# Altium schematic sheet SCH-3.SchDoc
size A4; Date: 05.05.2020; Organization: Günsel Model 1 Body Harness; Revision: v0.1
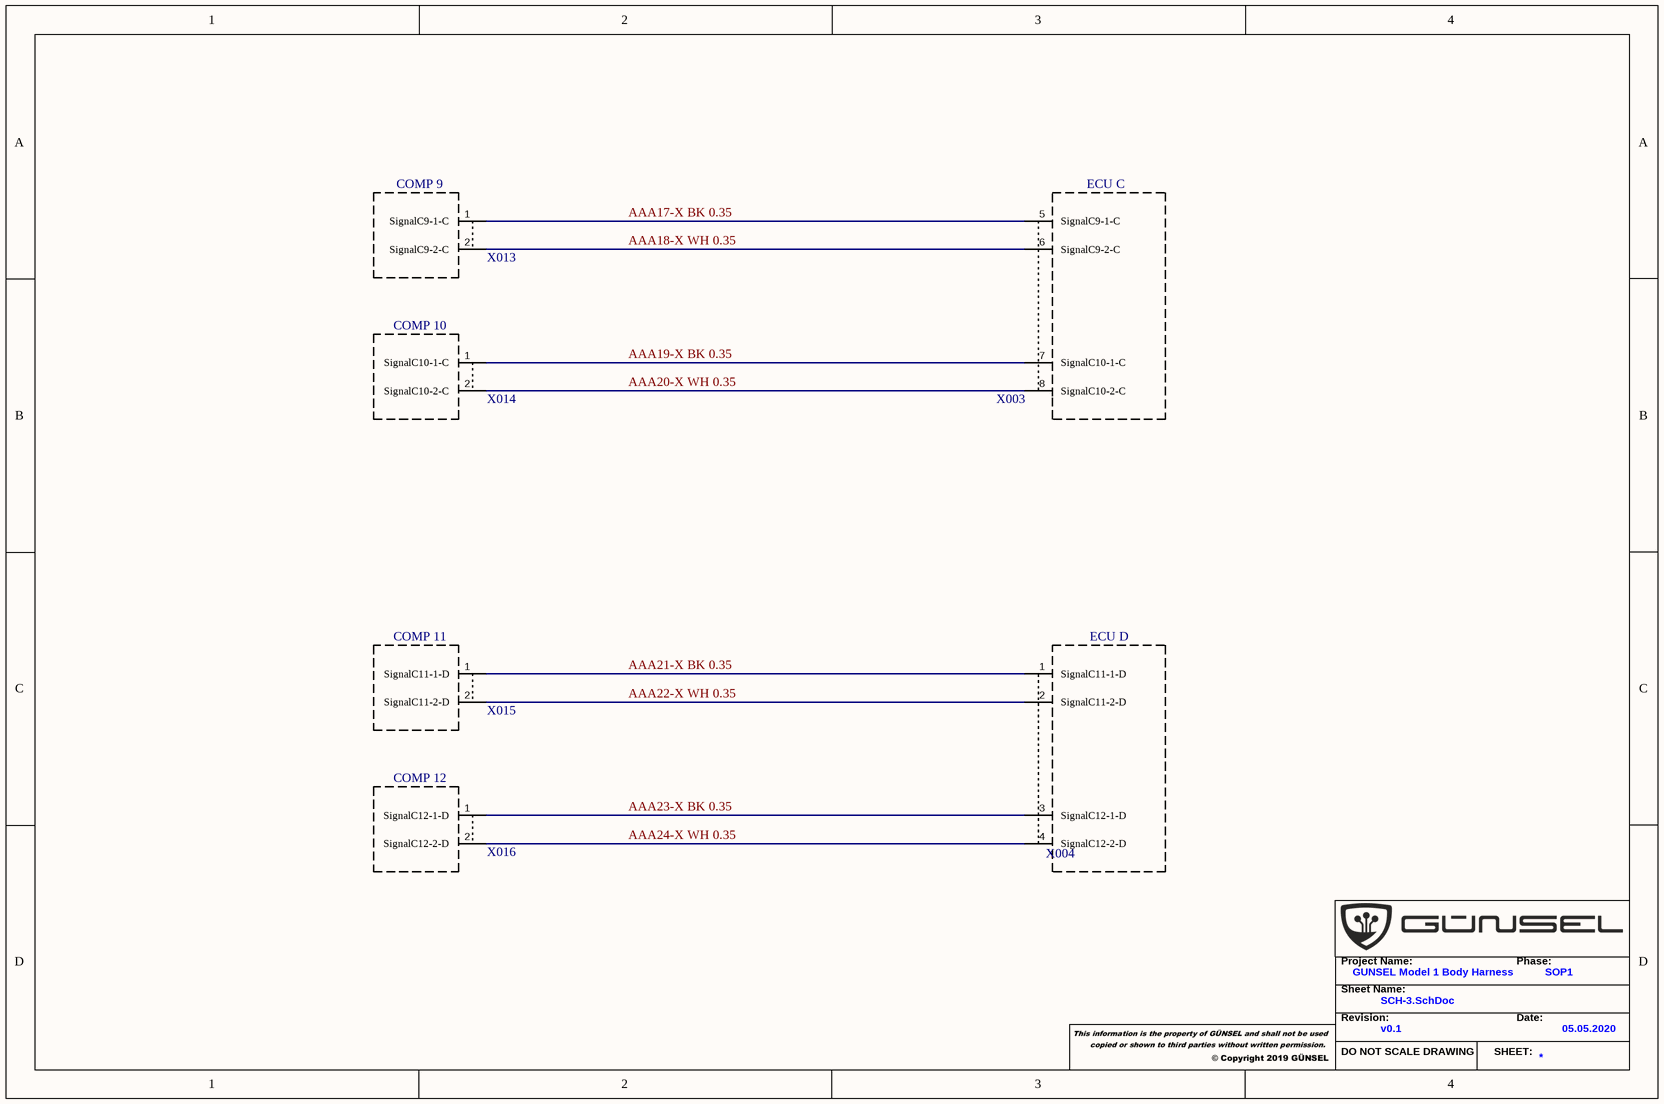
[diagram p0: SCH-3.SchDoc]

## Parts
X13  X003
X14  X013
X15  X014
X16  X004
X17  X015
X18  X016

## Blocks framed on the sheet
ECU D: X16

## Nets
AAA17-X BK 0.35: X13.5(SignalC9-1-C) X14.1(SignalC9-1-C)
AAA18-X WH 0.35: X13.6(SignalC9-2-C) X14.2(SignalC9-2-C)
AAA19-X BK 0.35: X13.7(SignalC10-1-C) X15.1(SignalC10-1-C)
AAA20-X WH 0.35: X13.8(SignalC10-2-C) X15.2(SignalC10-2-C)
AAA21-X BK 0.35: X16.1(SignalC11-1-D) X17.1(SignalC11-1-D)
AAA22-X WH 0.35: X16.2(SignalC11-2-D) X17.2(SignalC11-2-D)
AAA23-X BK 0.35: X16.3(SignalC12-1-D) X18.1(SignalC12-1-D)
AAA24-X WH 0.35: X16.4(SignalC12-2-D) X18.2(SignalC12-2-D)

Not connected (* = marked no-connect by the designer): X13 1 2 3 4 9 10 11 12 13 14 15 16 17 18 19 20; X14 3 4 5; X15 3 4 5; X16 5 6 7 8 9 10 11 12 13 14 15 16 17 18 19 20; X17 3 4 5; X18 3 4 5

## Notes on the sheet
- (near X14) COMP 9
- (near X13) ECU C
- (near X15) COMP 10
- (near X17) COMP 11
- (near X18) COMP 12
- Project Name:
- GUNSEL Model 1 Body Harness
- Phase:
- SOP1
- Sheet Name:
- Revision:
- DO NOT SCALE DRAWING
- SHEET:
- Date:

## Library data of the parts
X13 = ECU C: Designator_: X003; Pin count: 20; Manufacturer Part number: E-3
X14 = COMP 9: Designator_: X013; Pin count: 5; Manufacturer Part number: C-9
X15 = COMP 10: Designator_: X014; Pin count: 5; Manufacturer Part number: C-10
X16 = ECU D: Designator_: X004; Pin count: 20; Manufacturer Part number: E-4
X17 = COMP 11: Designator_: X015; Pin count: 5; Manufacturer Part number: C-11
X18 = COMP 12: Designator_: X016; Pin count: 5; Manufacturer Part number: C-12